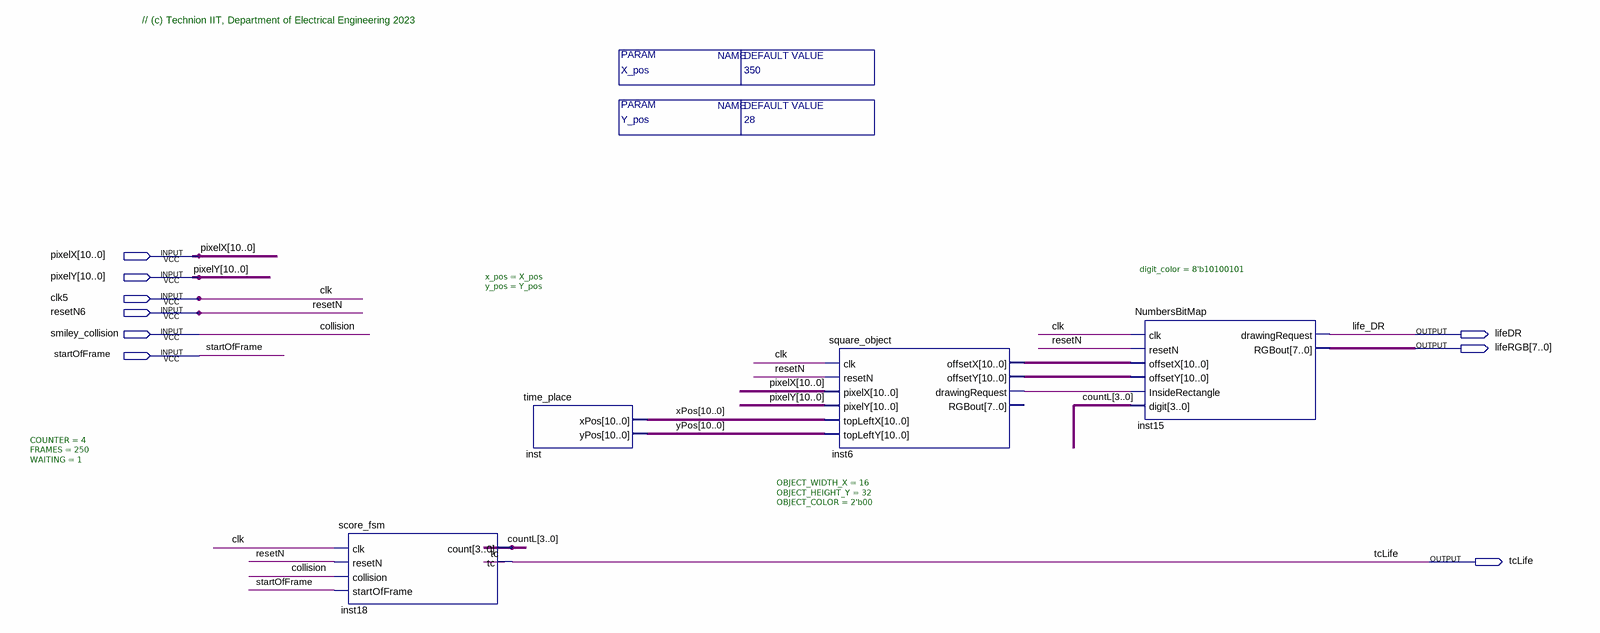
[diagram p0: schematic sheet]
// Quartus schematic score_Block_T.bdf as structural Verilog: 4 symbols, 9 pins
module score_Block_T #(parameter X_pos = 350, parameter Y_pos = 28) (
  input  [10:0] pixelX,
  input  [10:0] pixelY,
  input  clk5,
  input  resetN6,
  input  smiley_collision,
  input  startOfFrame,
  output lifeDR,
  output [7:0] lifeRGB,
  output tcLife
);

  wire inst6_drawingrequest;
  wire [3:0] countL;
  wire [10:0] inst6_offsetx, inst6_offsety, xPos, yPos;

  score_fsm #(.COUNTER(4), .FRAMES(250), .WAITING(1)) inst18 (
    .clk(clk5), .resetN(resetN6), .collision(smiley_collision), .startOfFrame(startOfFrame), .count(countL),
    .tc(tcLife));
  time_place #(.x_pos(X_pos), .y_pos(Y_pos)) inst (.xPos(xPos), .yPos(yPos));
  square_object #(.OBJECT_WIDTH_X(16), .OBJECT_HEIGHT_Y(32), .OBJECT_COLOR(2'b00)) inst6 (
    .clk(clk5), .resetN(resetN6), .pixelX(pixelX), .pixelY(pixelY), .topLeftX(xPos), .topLeftY(yPos),
    .offsetX(inst6_offsetx), .offsetY(inst6_offsety), .drawingRequest(inst6_drawingrequest));  // open: RGBout
  NumbersBitMap #(.digit_color(8'b10100101)) inst15 (
    .clk(clk5), .resetN(resetN6), .offsetX(inst6_offsetx), .offsetY(inst6_offsety),
    .InsideRectangle(inst6_drawingrequest), .digit(countL), .drawingRequest(lifeDR), .RGBout(lifeRGB));

  // Other names for the same wires on the sheet: clk = clk5; collision = smiley_collision; life_DR = lifeDR;
  //   resetN = resetN6

  // Notes on the sheet:
  //   // (c) Technion IIT, Department of Electrical Engineering 2023
endmodule
